# EasyEDA schematic SCH_Контроллер-кессона_2024-04-21.json
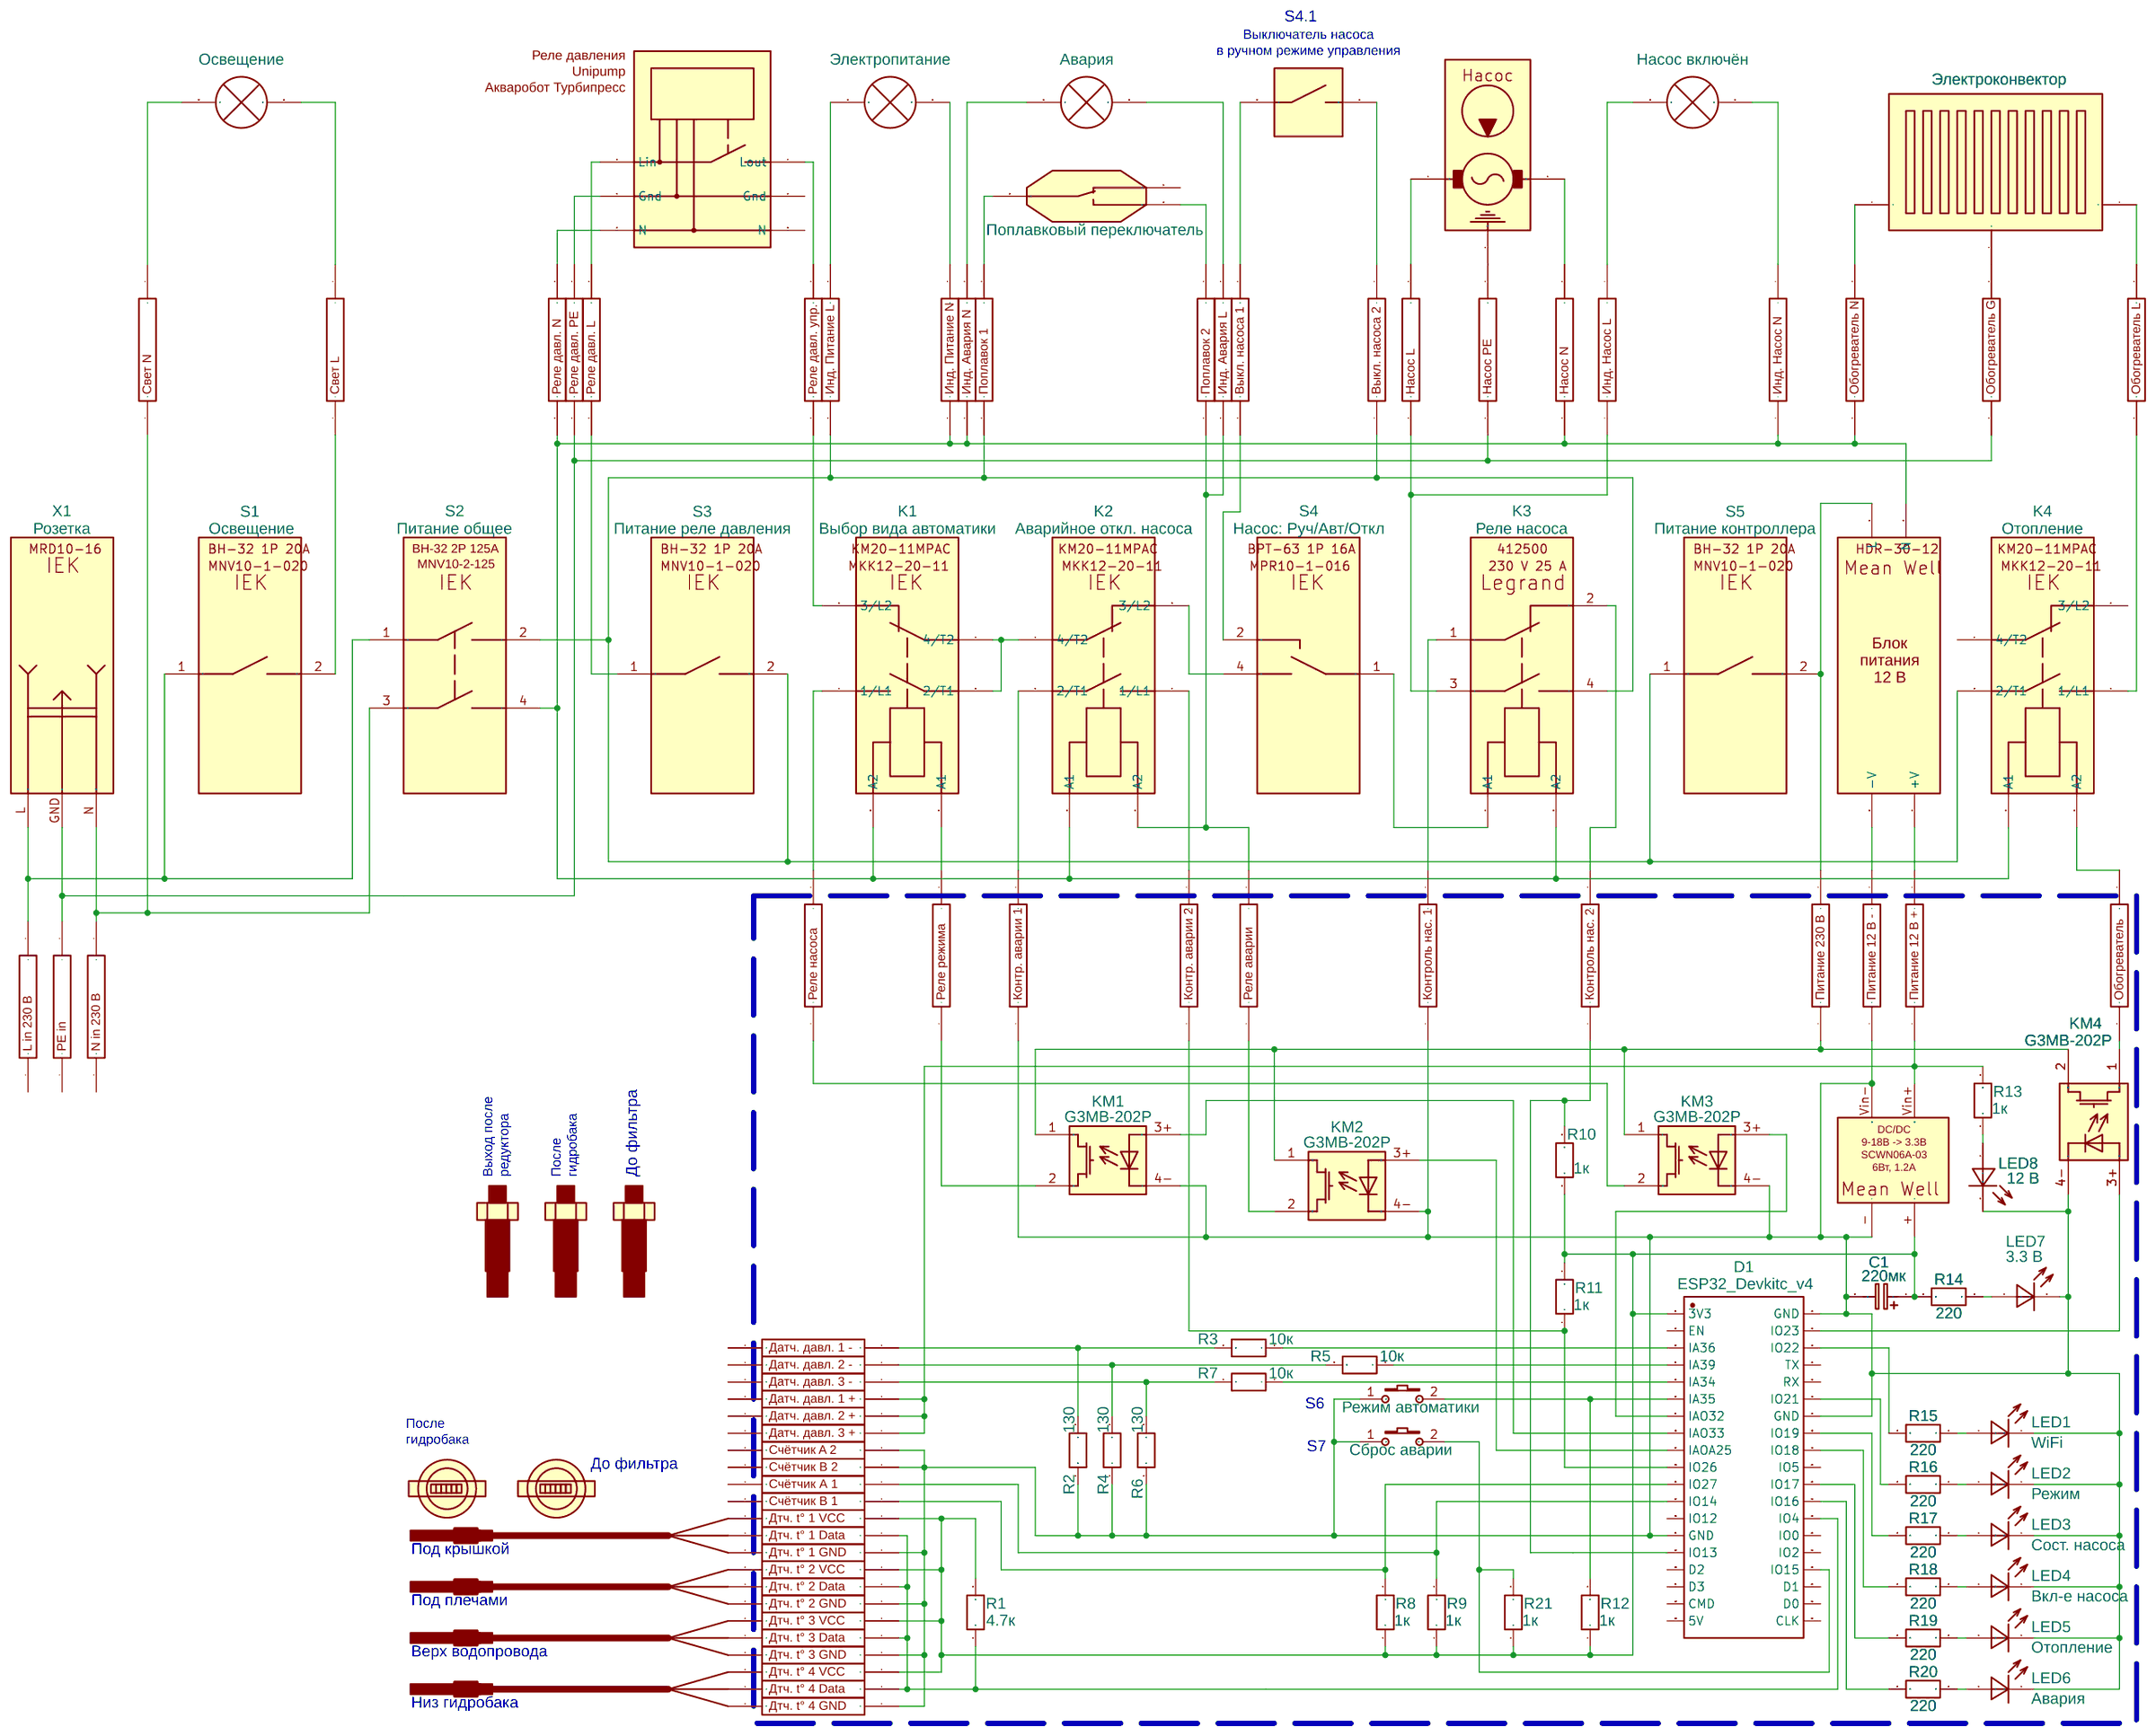
[diagram p0: schematic sheet]

## Parts
A1  none
A2  none
AAA  none
C1  220мк  [CASE-A_3216]
CNT  none
CNT1  none
D1  ESP32_Devkitc_v4
DD  none
DD1  none
DD2  none
H  Электроконвектор
K1  Выбор вида автоматики
K2  Аварийное откл. насоса
K3  Реле насоса
K4  Отопление
KEY1  Режим автоматики  [KEY-SMD_2P-L6.2-W3.6-LS8.0]
KEY2  Сброс аварии  [KEY-SMD_2P-L6.2-W3.6-LS8.0]
KM1  G3MB-202P
KM2  G3MB-202P
KM3  G3MB-202P
KM4  G3MB-202P
L  Освещение
L1  Электропитание
L2  Авария
L3  Насос включён
LED1  WiFi
LED2  Режим
LED3  Сост. насоса
LED4  Вкл-е насоса
LED5  Отопление
LED6  Авария
LED7  3.3 В
LED8  12 В
M1  none
R1  4.7к  [R0603]
R2  130  [R0603]
R3  10к  [R0603]
R4  130  [R0603]
R5  10к  [R0603]
R6  130  [R0603]
R7  10к  [R0603]
R8  1к  [R0603]
R9  1к  [R0603]
R10  1к  [R0603]
R11  1к  [R0603]
R12  1к  [R0603]
R13  1к  [R0603]
R14  220  [R0603]
R15  220  [R0603]
R16  220  [R0603]
R17  220  [R0603]
R18  220  [R0603]
R19  220  [R0603]
R20  220  [R0603]
R21  1к  [R0603]
S1  Освещение
S1#2  Поплавковый переключатель
S2  Питание общее
S2#2  Выключатель насоса   в ручном режиме управления
S3  Питание реле давления
S4  Насос: Руч/Авт/Откл
S5  Питание контроллера
ST1  none
ST2  none
ST3  none
ST4  none
X1  Розетка
X1#2  none
X2  none
X3  none
X4  none
X5  none
X6  none
X7  none
X8  none
X9  none
X10  none
X11  none
X12  none
X13  none
X14  none
X15  none
X16  none
X17  none
X18  none
X19  none
X20  none
X21  none
X22  none
X23  none
X24  none
X25  none
X26  none
X27  none
X28  none
X29  none
X30  none
X31  none
X32  none
X33  none
X34  none
X35  none
X36  none
X37  none
X38  none
X39  none
X40  none
X41  none
X42  none
X43  none
X44  none
X45  none
X46  none
X47  none
X48  none
X49  none
X50  none
X51  none
X52  none
X53  none
X54  none
X55  none
X56  none
X57  none
X58  none

## Library data of the parts
C1 = C_Tan_SMD_A_EU: Contributor: LCEDA_Lib
K1 K2 K4 = Реле с ручным управлением IEK: Manufacturer: IEK; Manufacturer Part: КМ20-11МР AC KARAT MKK12-20-11; Contributor: lipskiy
K3 = Реле с ручным управлением Legrand: Manufacturer: Legrand; Manufacturer Part: 412500 CX3 230V 1НО+1НЗ 25А; Contributor: lipskiy
KEY1 KEY2 = K2-3.6×6.1_SMD: Supplier Part: C118141; Supplier: LCSC; Manufacturer Part: K2-1107ST-A4SW-06; Contributor: LCEDA_Lib; 制造商: 韩国韩荣
R1-R21 = R_0603_EU: Contributor: LCEDA_Lib
S1 S3 S5 = Выключатель нагрузки однополюсный IEK: Manufacturer: IEK; Manufacturer Part: ВН-32 1Р 20А MNV10-1-020 IEK; Contributor: lipskiy
S2 = Выключатель нагрузки двухполюсный IEK: Manufacturer: IEK; Manufacturer Part: ВН-32 2Р 125А MNV10-2-125; Contributor: lipskiy
S4 = Переключатель трёхпозиционный однополюсный IEK: Manufacturer: IEK; Manufacturer Part: ВРТ-63 1P 16А MPR10-1-016; Contributor: lipskiy
X1 = Розетка IEK: Manufacturer: IEK; Manufacturer Part: MRD10-16; Contributor: lipskiy

## Nets
Net-(A1-1): A1.1(Lin) S3.1 X8.-
Net-(A1-2): A1.2(Gnd) A1.3(N) A2.11(L) AAA.- AAA.Vin+ AAA.Vin- C1.2 D1.J2-14(GND) D1.J3-1(GND) D1.J3-7(GND) H.- K1.A2 K2.2(2/T1) K2.A1 K2.A2 K3.1 K3.3 K3.4 K3.A2 K4.1(1/L1) K4.2(2/T1) K4.A1 KEY1.1 KEY2.1 KM1.1 KM1.4-(1) KM2.1 KM2.2 KM2.4-(1) KM3.1 KM3.4-(1) KM4.2 KM4.4-(1) L1.8(1) L2.8(1) L3.8(1) LED1.1 LED2.1 LED3.1 LED4.1 LED5.1 LED6.1 LED7.1 LED8.1 M1.7(N) R2.1 R4.1 R6.1 R13.1 R13.2 R14.1 R15.1 R16.1 R17.1 R18.1 R19.1 R20.1 S1#2.9(2) S2.2 S2.4 S2#2.10(3) S3.2 S4.2 S5.1 S5.2 X1.GND(3) X2.- X6.- X7.- X10.- X12.- X13.- X14.- X18.- X19.- X20.- X21.- X22.- X27.- X30.- X33.- X36.- X37.- X39.- X40.- X41.- X42.- X43.- X44.- X45.- X46.- X47.- X48.- X51.- X52.- X53.- X54.- X55.- X56.- X58.-
Net-(A1-4): A1.4(Lout) K1.3(3/L2) X9.-
Net-(AAA-+): AAA.+ C1.1 D1.J2-1(3V3) R1.2 R8.1 R9.1 R10.1 R11.2 R12.1 R14.2 R21.1 X25.- X28.- X31.- X34.-
Net-(D1-J2-3): D1.J2-3(IA36) R3.1
Net-(D1-J2-4): D1.J2-4(IA39) R5.1
Net-(D1-J2-5): D1.J2-5(IA34) R7.1
Net-(D1-J2-6): D1.J2-6(IA35) KEY1.2 R12.2
Net-(D1-J2-7): D1.J2-7(IAO32) KM3.3+
Net-(D1-J2-8): D1.J2-8(IAO33) KM1.3+
Net-(D1-J2-9): D1.J2-9(IAOA25) KM2.3+
Net-(D1-J2-10): D1.J2-10(IO26) K2.1(1/L1) R11.1 X38.-
Net-(D1-J2-11): D1.J2-11(IO27) R8.2 X24.-
Net-(D1-J2-12): D1.J2-12(IO14) R9.2 X23.-
Net-(D1-J2-15): D1.J2-15(IO13) K3.2 R10.2 X49.-
Net-(D1-J3-2): D1.J3-2(IO23) KM4.3+
Net-(D1-J3-3): D1.J3-3(IO22) R15.2
Net-(D1-J3-6): D1.J3-6(IO21) R16.2
Net-(D1-J3-8): D1.J3-8(IO19) R17.2
Net-(D1-J3-9): D1.J3-9(IO18) R18.2
Net-(D1-J3-11): D1.J3-11(IO17) R19.2
Net-(D1-J3-12): D1.J3-12(IO16) R20.2
Net-(D1-J3-13): D1.J3-13(IO4) R1.1 X26.- X29.- X32.- X35.-
Net-(D1-J3-16): D1.J3-16(IO15) KEY2.2 R21.2
Net-(K1-1): K1.1(1/L1) KM3.2 X50.-
Net-(K1-2): K1.2(2/T1) K1.4(4/T2) K2.4(4/T2)
Net-(K1-A1): K1.A1 KM1.2 X11.-
Net-(K2-3): K2.3(3/L2) S4.4
Net-(K3-A1): K3.A1 S4.1
Net-(K4-A2): K4.A2 KM4.1 X57.-
Net-(L-8): L.8(1) S1.2 S2.3 X1.N(2) X3.- X4.- X5.-
Net-(R2-2): R2.2 R3.2 X15.-
Net-(R4-2): R4.2 R5.2 X16.-
Net-(R6-2): R6.2 R7.2 X17.-
Net-(S1-1): S1.1 S2.1 X1.L(1) X1#2.-

Not connected (* = marked no-connect by the designer): A1 5(Gnd) 6(N); D1 J2-2(EN) J2-13(IO12) J2-16(D2) J2-17(D3) J2-18(CMD) J2-19(5V) J3-4(TX) J3-5(RX) J3-10(IO5) J3-14(IO0) J3-15(IO2) J3-17(D1) J3-18(D0) J3-19(CLK); K4 3(3/L2) 4(4/T2)

## Notes on the sheet
- S4.1
- Выключатель насоса
  в ручном режиме управления
- Выход после
  редуктора
- После
  гидробака
- До фильтра
- S6
- После
  гидробака
- S7
- До фильтра
- Под крышкой
- Под плечами
- Верх водопровода
- Низ гидробака
